# EAGLE schematic Placa de Baixo (EAGLE 9.3.0)
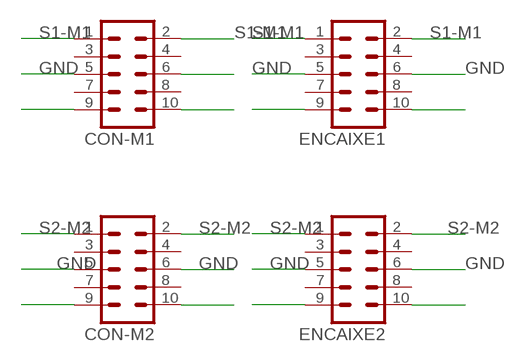
[diagram p0: schematic, sheet 1]

## Parts
CON-M1  MA05-2  [MA05-2]
CON-M2  MA05-2  [MA05-2]
ENCAIXE1  ML10L  [ML10L]
ENCAIXE2  ML10L  [ML10L]

## Nets
COMANDO-1: CON-M1.9 ENCAIXE1.10
COMANDO-2: CON-M1.10 ENCAIXE1.9
COMANDO-A: CON-M2.9 ENCAIXE2.10
COMANDO-B: CON-M2.10 ENCAIXE2.9
GND: CON-M1.5 CON-M1.6 CON-M2.5 CON-M2.6 ENCAIXE1.5 ENCAIXE1.6 ENCAIXE2.5 ENCAIXE2.6
S1-M1: CON-M1.1 CON-M1.2 ENCAIXE1.1 ENCAIXE1.2
S2-M2: CON-M2.1 CON-M2.2 ENCAIXE2.1 ENCAIXE2.2
Unconnected: CON-M1.3 CON-M1.4 CON-M1.7 CON-M1.8 CON-M2.3 CON-M2.4 CON-M2.7 CON-M2.8 ENCAIXE1.3 ENCAIXE1.4 ENCAIXE1.7 ENCAIXE1.8 ENCAIXE2.3 ENCAIXE2.4 ENCAIXE2.7 ENCAIXE2.8

## Library data of the parts
CON-M1 CON-M2 = con-lstb:MA05-2: PIN HEADER; OC_FARNELL: unknown; OC_NEWARK: unknown
ENCAIXE1 ENCAIXE2 = con-ml:ML10L: HARTING; OC_FARNELL: unknown; OC_NEWARK: unknown